# Altium schematic sheet IMX8_DISPLAY.SchDoc
size 594 x 420 mm; SheetNumber: 8; SheetTotal: 12
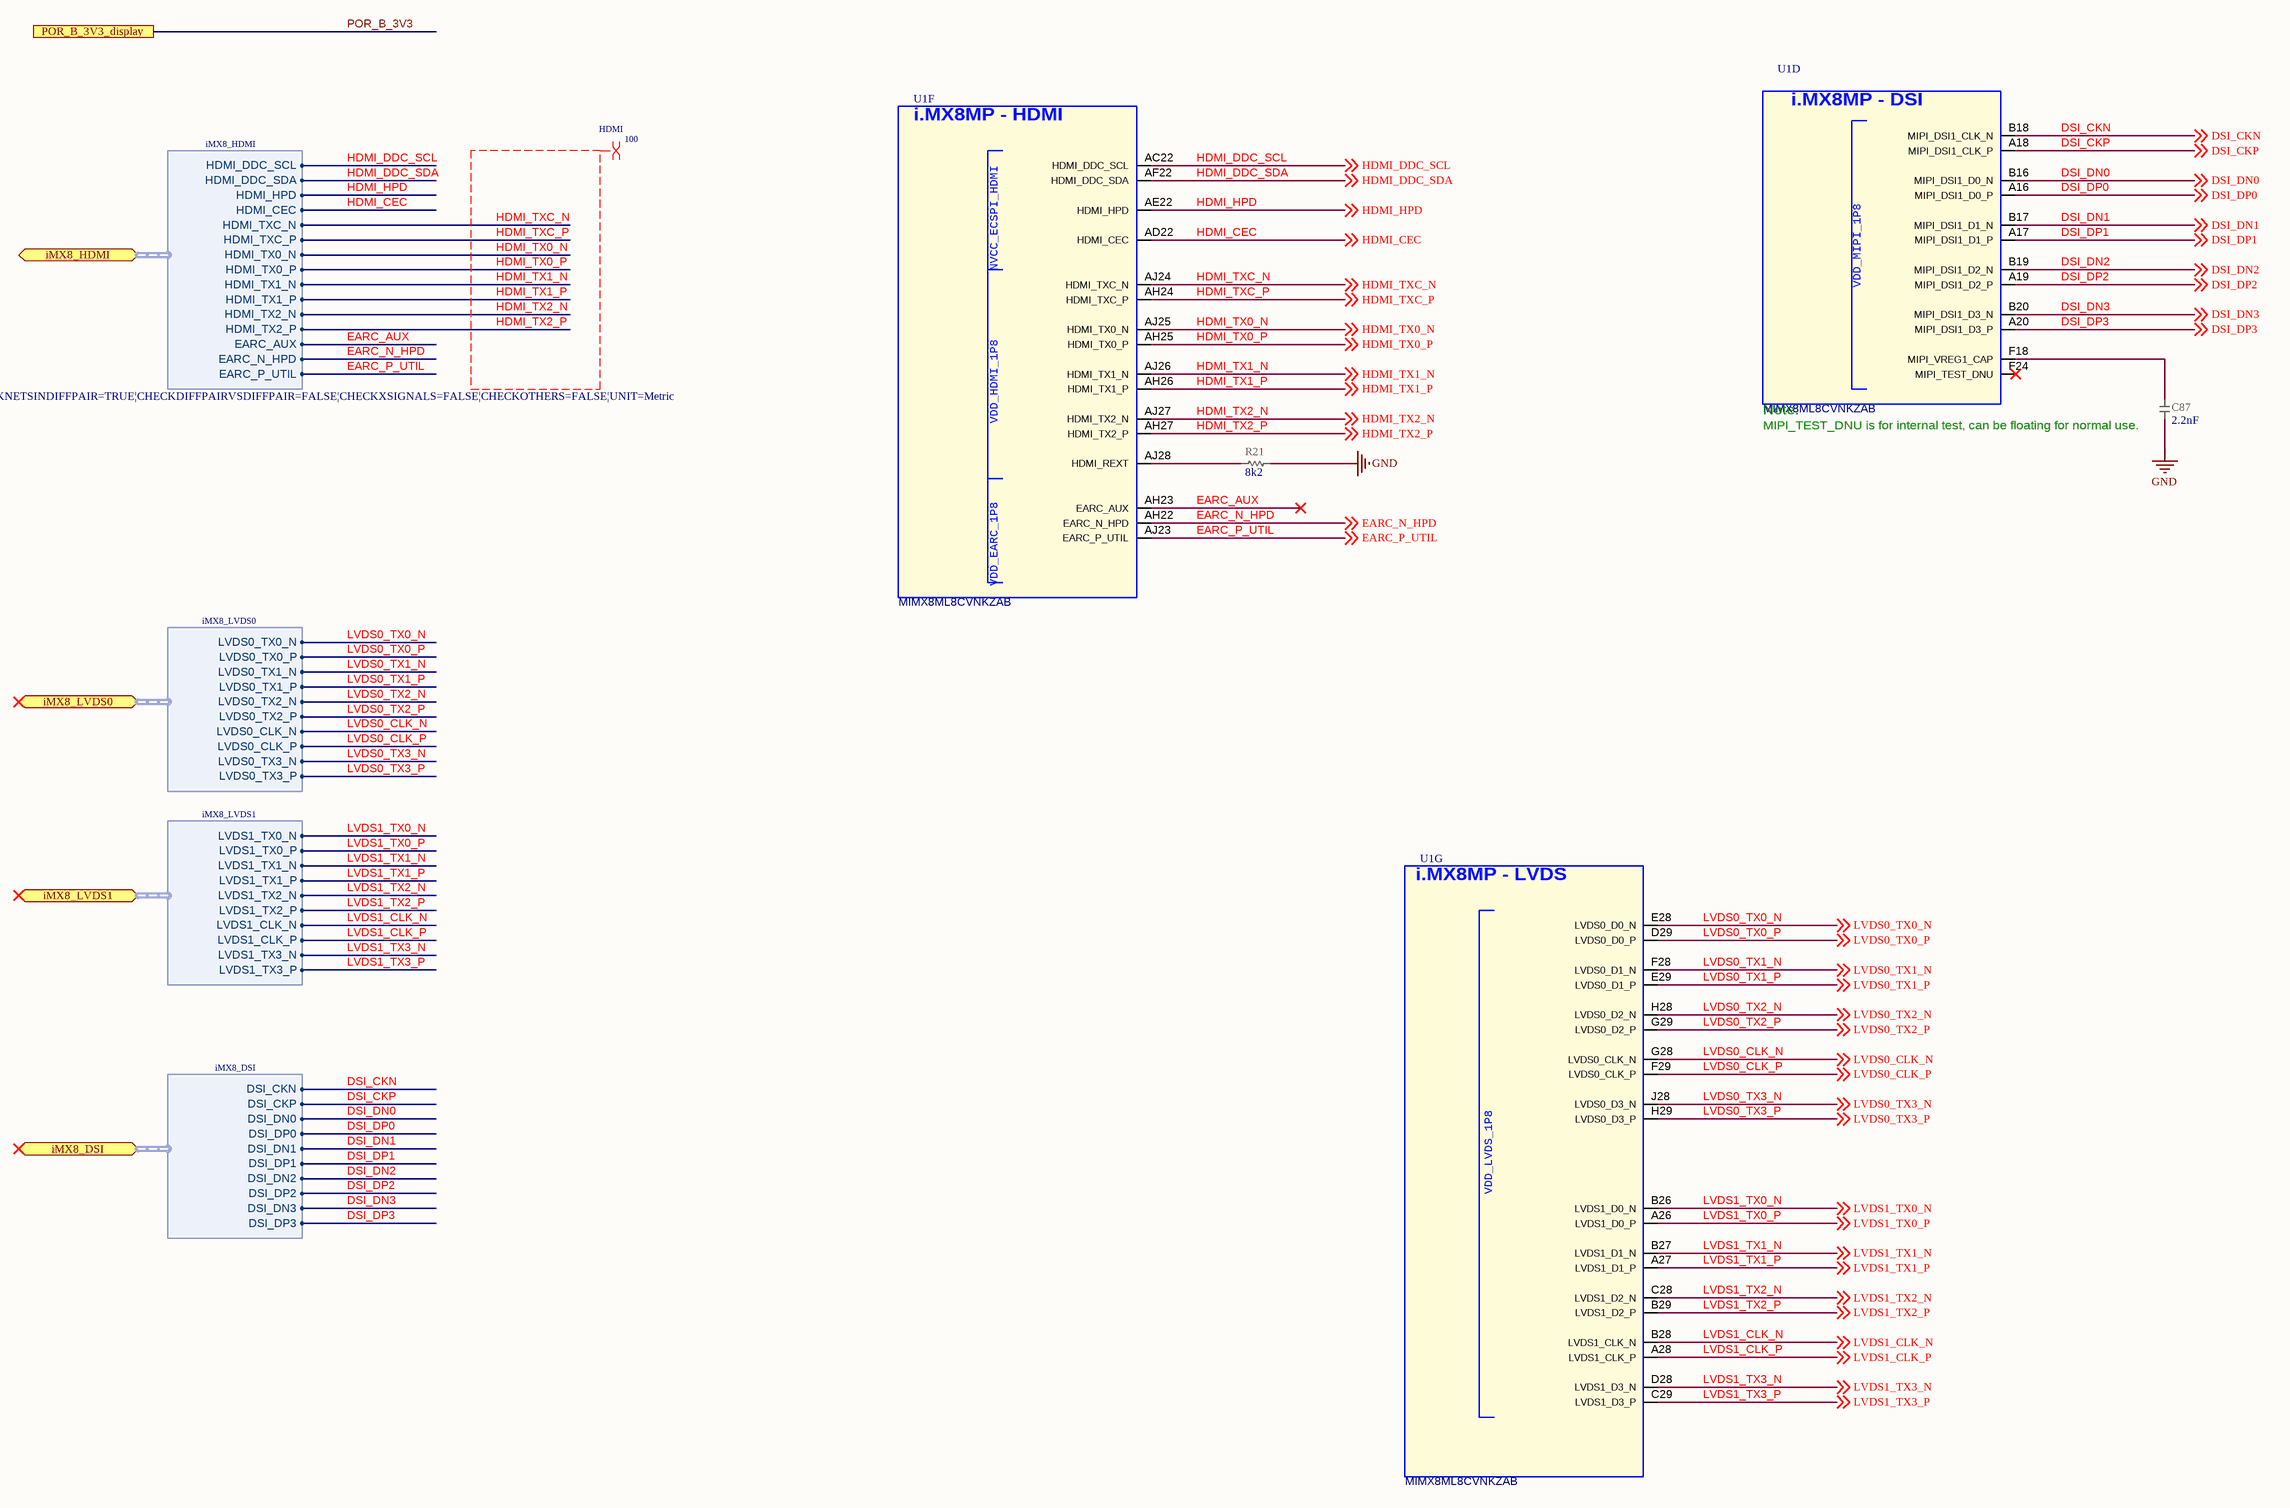
[diagram p0: IMX8_DISPLAY.SchDoc]

## Parts
C87  value 2.2nF  [CAP_0201_UN1Q]  (hidden comment: CAP_0201_2n2)
R21  value 8k2  [RES_0201_UN1Q]  (hidden comment: RES_0201_8k2)
U1  MIMX8ML8CVNKZAB  [BGA548C50P29X29_1500X1500X148]  (parts D,F,G of 15)

## Ports
iMX8_DSI (bidir, harness iMX8_DSI), iMX8_HDMI (bidir, harness iMX8_HDMI), iMX8_LVDS0 (bidir, harness iMX8_LVDS0), iMX8_LVDS1 (bidir, harness iMX8_LVDS1), POR_B_3V3_display

## Harnesses
iMX8_LVDS0: LVDS0_TX0_N, LVDS0_TX0_P, LVDS0_TX1_N, LVDS0_TX1_P, LVDS0_TX2_N, LVDS0_TX2_P, LVDS0_CLK_N, LVDS0_CLK_P, LVDS0_TX3_N, LVDS0_TX3_P
iMX8_LVDS1: LVDS1_TX0_N, LVDS1_TX0_P, LVDS1_TX1_N, LVDS1_TX1_P, LVDS1_TX2_N, LVDS1_TX2_P, LVDS1_CLK_N, LVDS1_CLK_P, LVDS1_TX3_N, LVDS1_TX3_P
iMX8_DSI: DSI_CKN, DSI_CKP, DSI_DN0, DSI_DP0, DSI_DN1, DSI_DP1, DSI_DN2, DSI_DP2, DSI_DN3, DSI_DP3
iMX8_HDMI: HDMI_DDC_SCL, HDMI_DDC_SDA, HDMI_HPD, HDMI_CEC, EARC_AUX, EARC_N_HPD, EARC_P_UTIL, HDMI_TXC_N, HDMI_TXC_P, HDMI_TX0_N, HDMI_TX0_P, HDMI_TX1_N, HDMI_TX1_P, HDMI_TX2_N, HDMI_TX2_P

## Nets
GND: C87.1 R21.2
DSI_CKN: U1.B18(MIPI_DSI1_CLK_N) ; off-sheet DSI_CKN, port iMX8_DSI.DSI_CKN
DSI_CKP: U1.A18(MIPI_DSI1_CLK_P) ; off-sheet DSI_CKP, port iMX8_DSI.DSI_CKP
DSI_DN0: U1.B16(MIPI_DSI1_D0_N) ; off-sheet DSI_DN0, port iMX8_DSI.DSI_DN0
DSI_DN1: U1.B17(MIPI_DSI1_D1_N) ; off-sheet DSI_DN1, port iMX8_DSI.DSI_DN1
DSI_DN2: U1.B19(MIPI_DSI1_D2_N) ; off-sheet DSI_DN2, port iMX8_DSI.DSI_DN2
DSI_DN3: U1.B20(MIPI_DSI1_D3_N) ; off-sheet DSI_DN3, port iMX8_DSI.DSI_DN3
DSI_DP0: U1.A16(MIPI_DSI1_D0_P) ; off-sheet DSI_DP0, port iMX8_DSI.DSI_DP0
DSI_DP1: U1.A17(MIPI_DSI1_D1_P) ; off-sheet DSI_DP1, port iMX8_DSI.DSI_DP1
DSI_DP2: U1.A19(MIPI_DSI1_D2_P) ; off-sheet DSI_DP2, port iMX8_DSI.DSI_DP2
DSI_DP3: U1.A20(MIPI_DSI1_D3_P) ; off-sheet DSI_DP3, port iMX8_DSI.DSI_DP3
EARC_AUX: U1.AH23(EARC_AUX) ; port iMX8_HDMI.EARC_AUX
EARC_N_HPD: U1.AH22(EARC_N_HPD) ; off-sheet EARC_N_HPD, port iMX8_HDMI.EARC_N_HPD
EARC_P_UTIL: U1.AJ23(EARC_P_UTIL) ; off-sheet EARC_P_UTIL, port iMX8_HDMI.EARC_P_UTIL
HDMI_CEC: U1.AD22(HDMI_CEC) ; off-sheet HDMI_CEC, port iMX8_HDMI.HDMI_CEC
HDMI_DDC_SCL: U1.AC22(HDMI_DDC_SCL) ; off-sheet HDMI_DDC_SCL, port iMX8_HDMI.HDMI_DDC_SCL
HDMI_DDC_SDA: U1.AF22(HDMI_DDC_SDA) ; off-sheet HDMI_DDC_SDA, port iMX8_HDMI.HDMI_DDC_SDA
HDMI_HPD: U1.AE22(HDMI_HPD) ; off-sheet HDMI_HPD, port iMX8_HDMI.HDMI_HPD
HDMI_TX0_N: U1.AJ25(HDMI_TX0_N) ; off-sheet HDMI_TX0_N, port iMX8_HDMI.HDMI_TX0_N
HDMI_TX0_P: U1.AH25(HDMI_TX0_P) ; off-sheet HDMI_TX0_P, port iMX8_HDMI.HDMI_TX0_P
HDMI_TX1_N: U1.AJ26(HDMI_TX1_N) ; off-sheet HDMI_TX1_N, port iMX8_HDMI.HDMI_TX1_N
HDMI_TX1_P: U1.AH26(HDMI_TX1_P) ; off-sheet HDMI_TX1_P, port iMX8_HDMI.HDMI_TX1_P
HDMI_TX2_N: U1.AJ27(HDMI_TX2_N) ; off-sheet HDMI_TX2_N, port iMX8_HDMI.HDMI_TX2_N
HDMI_TX2_P: U1.AH27(HDMI_TX2_P) ; off-sheet HDMI_TX2_P, port iMX8_HDMI.HDMI_TX2_P
HDMI_TXC_N: U1.AJ24(HDMI_TXC_N) ; off-sheet HDMI_TXC_N, port iMX8_HDMI.HDMI_TXC_N
HDMI_TXC_P: U1.AH24(HDMI_TXC_P) ; off-sheet HDMI_TXC_P, port iMX8_HDMI.HDMI_TXC_P
LVDS0_CLK_N: U1.G28(LVDS0_CLK_N) ; off-sheet LVDS0_CLK_N, port iMX8_LVDS0.LVDS0_CLK_N
LVDS0_CLK_P: U1.F29(LVDS0_CLK_P) ; off-sheet LVDS0_CLK_P, port iMX8_LVDS0.LVDS0_CLK_P
LVDS0_TX0_N: U1.E28(LVDS0_D0_N) ; off-sheet LVDS0_TX0_N, port iMX8_LVDS0.LVDS0_TX0_N
LVDS0_TX0_P: U1.D29(LVDS0_D0_P) ; off-sheet LVDS0_TX0_P, port iMX8_LVDS0.LVDS0_TX0_P
LVDS0_TX1_N: U1.F28(LVDS0_D1_N) ; off-sheet LVDS0_TX1_N, port iMX8_LVDS0.LVDS0_TX1_N
LVDS0_TX1_P: U1.E29(LVDS0_D1_P) ; off-sheet LVDS0_TX1_P, port iMX8_LVDS0.LVDS0_TX1_P
LVDS0_TX2_N: U1.H28(LVDS0_D2_N) ; off-sheet LVDS0_TX2_N, port iMX8_LVDS0.LVDS0_TX2_N
LVDS0_TX2_P: U1.G29(LVDS0_D2_P) ; off-sheet LVDS0_TX2_P, port iMX8_LVDS0.LVDS0_TX2_P
LVDS0_TX3_N: U1.J28(LVDS0_D3_N) ; off-sheet LVDS0_TX3_N, port iMX8_LVDS0.LVDS0_TX3_N
LVDS0_TX3_P: U1.H29(LVDS0_D3_P) ; off-sheet LVDS0_TX3_P, port iMX8_LVDS0.LVDS0_TX3_P
LVDS1_CLK_N: U1.B28(LVDS1_CLK_N) ; off-sheet LVDS1_CLK_N, port iMX8_LVDS1.LVDS1_CLK_N
LVDS1_CLK_P: U1.A28(LVDS1_CLK_P) ; off-sheet LVDS1_CLK_P, port iMX8_LVDS1.LVDS1_CLK_P
LVDS1_TX0_N: U1.B26(LVDS1_D0_N) ; off-sheet LVDS1_TX0_N, port iMX8_LVDS1.LVDS1_TX0_N
LVDS1_TX0_P: U1.A26(LVDS1_D0_P) ; off-sheet LVDS1_TX0_P, port iMX8_LVDS1.LVDS1_TX0_P
LVDS1_TX1_N: U1.B27(LVDS1_D1_N) ; off-sheet LVDS1_TX1_N, port iMX8_LVDS1.LVDS1_TX1_N
LVDS1_TX1_P: U1.A27(LVDS1_D1_P) ; off-sheet LVDS1_TX1_P, port iMX8_LVDS1.LVDS1_TX1_P
LVDS1_TX2_N: U1.C28(LVDS1_D2_N) ; off-sheet LVDS1_TX2_N, port iMX8_LVDS1.LVDS1_TX2_N
LVDS1_TX2_P: U1.B29(LVDS1_D2_P) ; off-sheet LVDS1_TX2_P, port iMX8_LVDS1.LVDS1_TX2_P
LVDS1_TX3_N: U1.D28(LVDS1_D3_N) ; off-sheet LVDS1_TX3_N, port iMX8_LVDS1.LVDS1_TX3_N
LVDS1_TX3_P: U1.C29(LVDS1_D3_P) ; off-sheet LVDS1_TX3_P, port iMX8_LVDS1.LVDS1_TX3_P
POR_B_3V3: port POR_B_3V3_display
NetC87_2: C87.2 U1.F18(MIPI_VREG1_CAP)
NetR21_1: R21.1 U1.AJ28(HDMI_REXT)

Not connected (* = marked no-connect by the designer): U1 F24(MIPI_TEST_DNU)*

## Layout directives
differential pair; net class HDMI; rule Matched Net Lengths [Tolerance = 0.1mm]; differential pair class 100: HDMI_TX0_N, HDMI_TX0_P, HDMI_TX1_N, HDMI_TX1_P, HDMI_TX2_N, HDMI_TX2_P, HDMI_TXC_N, HDMI_TXC_P

## Notes on the sheet
- Note:
- (near C87) MIPI_TEST_DNU is for internal test, can be floating for normal use.
- DWG NO:
- REV:
- THIS DOCUMENT AND THE DATA DISCLOSED HEREIN OR
- HEREWITH IS THE PROPERTY OF ALTIUM LIMITED AND MAY
- BE FREELY DISTRIBUTED IN WHOLE. NO RIGHTS ARE
- RESERVED OR EXPRESS OR IMPLIED WARANTEE GIVEN.
- REVISION
- DESCRIPTION
- DATE
- APPROVED
- ENG:
- APPROVALS
- PROJECT
- DSN:
- CHK:
- REFERENCE DOCUMENTS
- PROJECT REVISION:
- TITLE
- DOCUMENT REVISION:
- DESIGN ITEM:
- BOM:
- FAB DWG:
- PCB DWG:
- ASSY DWG:
- SCALE:
- A2
- SIZE
- CAGE CODE
- FILE NAME
- DWG NO.
- SHEET
- OF
- REV
- (in symbol CMP-001-000983-8, part D) i.MX8MP - DSI
- (in symbol CMP-001-000983-8, part F) i.MX8MP - HDMI
- (in symbol CMP-001-000983-8, part G) i.MX8MP - LVDS

## Library data of the parts
C87 = CMP-001-000281-14: CAP; Part Number: GRM033R71E222KA12J; Manufacturer: Murata; Temperature characteristics: X7R; Tolerance: +/-10%; Sort order: 302; HasBeenBuilt: TBD; Alternative component: Allowed; Voltage: 25V; System: RLC; Package: 0201; ComponentLink1Description: 1_Datasheet; ComponentLink2Description: 2_Product page; ComponentLink3Description: 3_X-information; ComponentLink4Description: 4_X-information; Creation date: 20222504; ClassName: SMALL; Source: RLC_UN1Q.SchLib; Manufacturer Part Number: GRM033R71E222KA12J; Component Type: Capacitor
R21 = CMP-001-001255-9: RES; Part Number: ERJ1GNF8201C; Manufacturer: Panasonic Electronic Components; Tolerance: 1%; Power Rating: 1/20W; Sort order: 322; Alternative component: Allowed; System: RLC; Package: 0201; ClassName: SMALL; ComponentLink1Description: 1_Datasheet; ComponentLink2Description: 2_Product page; ComponentLink3Description: 3_X-information; ComponentLink4Description: 4_X-information; Creation date: 20240404; Component Type: Resistor
U1 = CMP-001-000983-8: CPU QUAD CORTEX A53+M4 1.6GHZ BGA548 Industrial; Manufacturer: NXP Semiconductors; Sort order: 501; System: IC; ComponentLink1Description: 1_Datasheet; ComponentLink1URL: https://www.nxp.com/part/MIMX8ML8CVNKZAB#/; ComponentLink2Description: 2_Product page; ComponentLink3Description: 3_X-information; ComponentLink4Description: 4_X-information; Creation date: 20240524; Dimensions WxLxH: 15 x 15 x 1.33mm; Operating temperature range: -40... +105 °C; Package: FCBGA548; Part Number: MIMX8ML8CVNKZAB; ClassName: BIG; Source: UUDET_KOMPONENTIT.SchLib; Design Item ID: MIMX8ML8CVNKZAB; Manufacturer Part Number: MIMX8ML8CVNKZAB; Component Type: Processor